# EAGLE design SaintCon2017Badge (EAGLE 7.5.0)
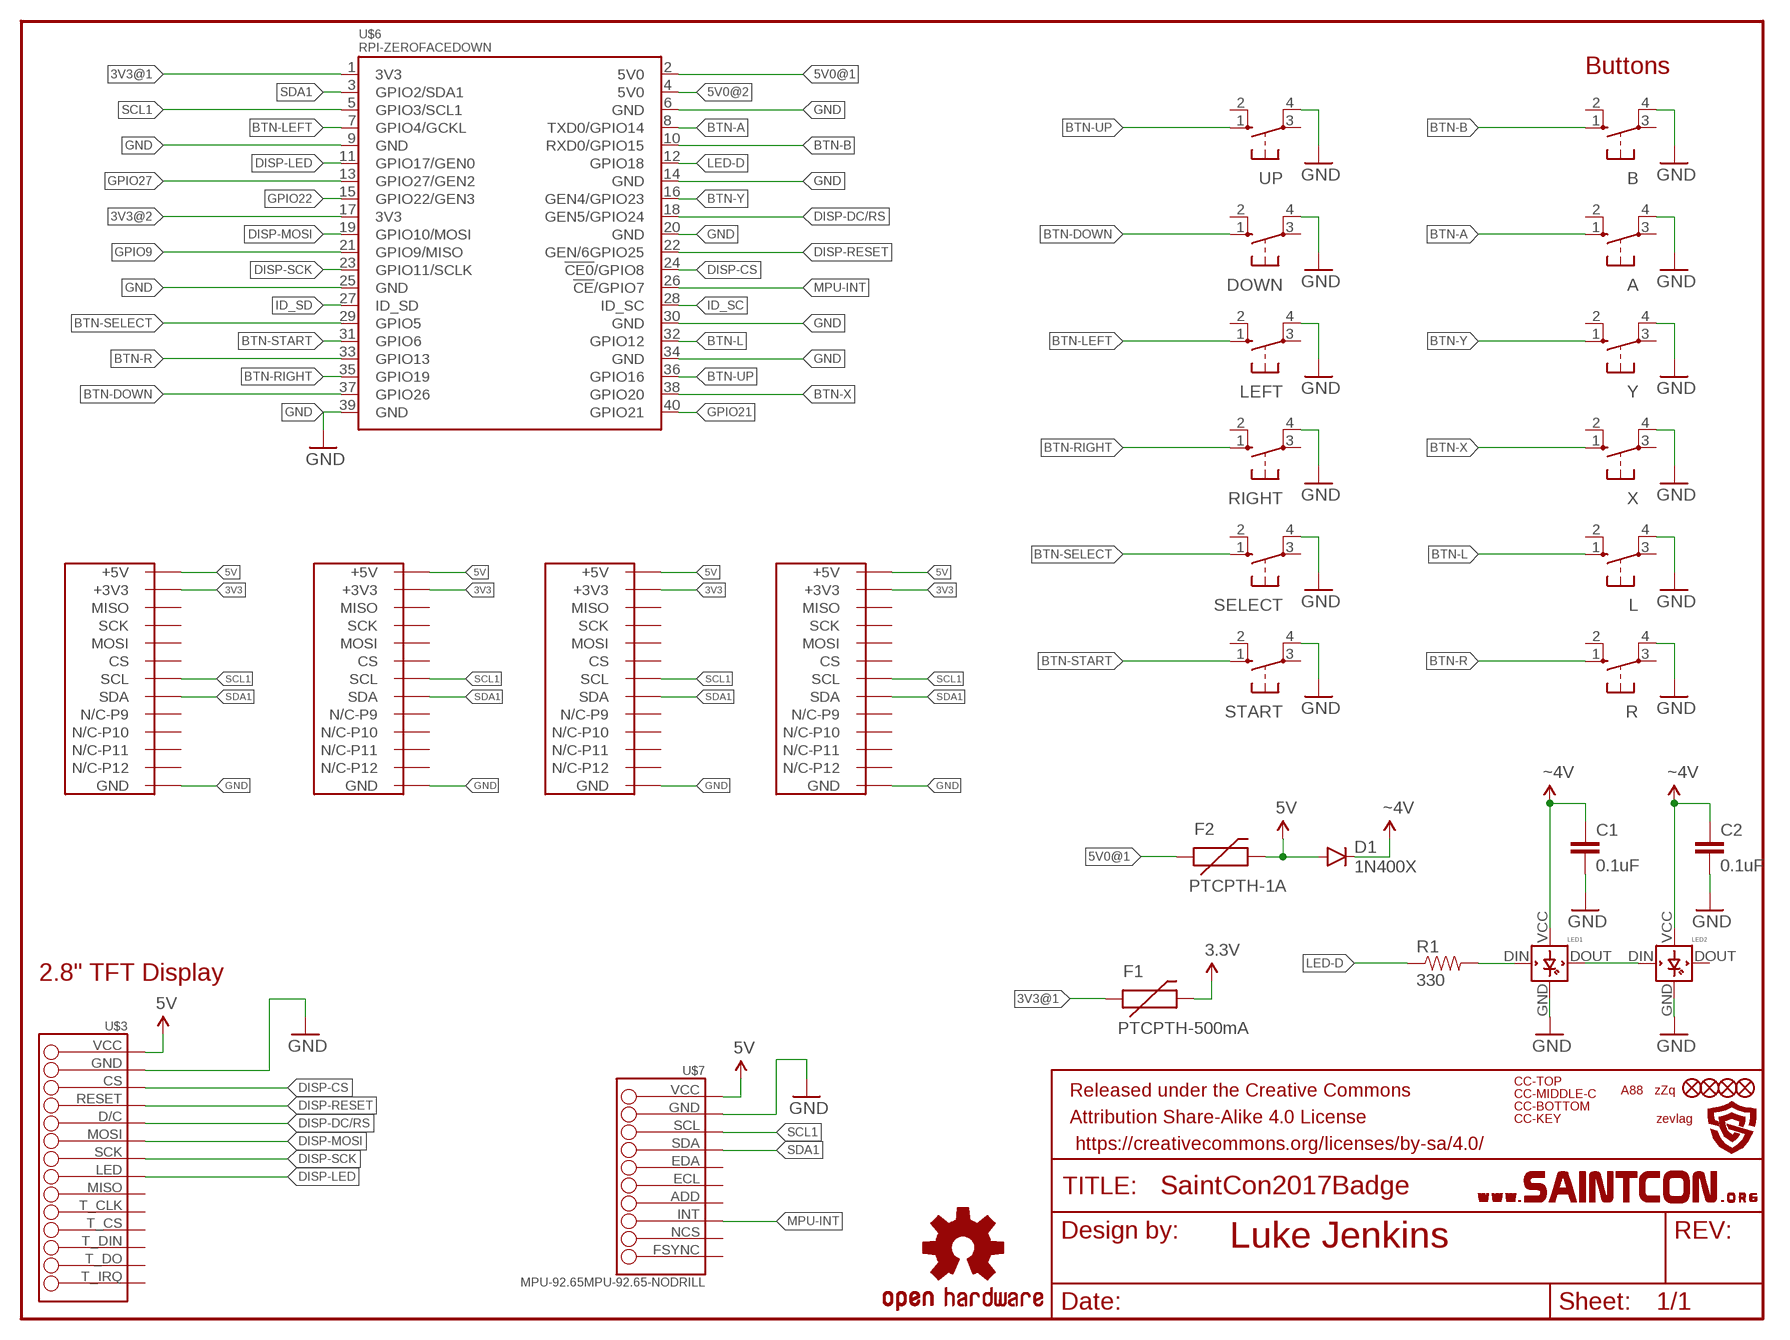
[diagram p0: schematic, sheet 1]

## Parts
A  10-XX  [B3F-10XX]
B  10-XX  [B3F-10XX]
C1  0.1uF  CAPPTH2  [CAP-PTH-SMALL2]
C2  0.1uF  CAPPTH2  [CAP-PTH-SMALL2]
D1  1N400X  DIODEPTH  [DIODE-1N4001]
DOWN  10-XX  [B3F-10XX]
F1  PTCPTH-500mA  PTCPTH  [PTC]
F2  PTCPTH-1A  PTCPTH  [PTC]
FID1  FIDUCIAL1X2  [FIDUCIAL-1X2]
FID2  FIDUCIAL1X2  [FIDUCIAL-1X2]
FID3  FIDUCIAL1X2  [FIDUCIAL-1X2]
FID4  FIDUCIAL1X2  [FIDUCIAL-1X2]
FRAME3  FRAME-LETTERNO_PACKAGE  [DUMMY]
L  10-XX  [B3F-10XX]
LED1  WS2812WS2812-F8-FLIPPED-POWER  [WS2812-F8-FLIPPED-POWER]
LED2  WS2812WS2812-F8-FLIPPED-POWER  [WS2812-F8-FLIPPED-POWER]
LEFT  10-XX  [B3F-10XX]
LOGO1  OSHW-LOGOS-COPPER  [OSHW-LOGO-S_COPPER]
LOGO2  OSHW-LOGOS  [OSHW-LOGO-S]
R  10-XX  [B3F-10XX]
R1  330  RESISTORPTH-1/4W  [AXIAL-0.4]
RIGHT  10-XX  [B3F-10XX]
SELECT  10-XX  [B3F-10XX]
START  10-XX  [B3F-10XX]
U$1  AZZQ  [AZZQ]
U$2  A88  [A88]
U$3  TFT28-14  [TFT28-14]
U$4  SAINTCON-LOGO  [SAINTCON-LOGO]
U$5  SAINTCON-HEADERBLOCKLETTER  [SAINTCON-HEADER-BLOCK-LETTER]
U$6  RPI-ZEROFACEDOWN  [RASP_PI_ZERO_BOARD_FULL]
U$7  MPU-92.65MPU-92.65-NODRILL  [MPU-92.65-NODRILL]
U$8  BADGE64FOOTPRINT-SHINY  [BADGE64-FOOTPRINT-SHINY]
U$9  BADGE64FOOTPRINT-SHINY  [BADGE64-FOOTPRINT-SHINY]
U$10  BADGE64FOOTPRINT-SHINY  [BADGE64-FOOTPRINT-SHINY]
U$11  BADGE64FOOTPRINT-SHINY  [BADGE64-FOOTPRINT-SHINY]
U$12  ZEVLAG2017SOLID-IS-BLACK  [ZEVLAG2017-SOLID-IS-BLACK]
U$13  CC-TOP  [CURIOUSCODES-2017SAINTCON-TOP-LINE]
U$14  CC-MIDDLE-C  [CURIOUSCODES-2017SAINTCON-MIDDLE-C]
U$15  CC-BOTTOM  [CURIOUSCODES-2017SAINTCON-BOTTOM-LINE]
U$16  CC-KEY  [CUROIOUSCODES-KEY-HALF-INCH]
UP  10-XX  [B3F-10XX]
X  10-XX  [B3F-10XX]
Y  10-XX  [B3F-10XX]

## Nets
3V3: F1.P$2 U$8.+3V3-P7(+3V3) U$8.+3V3-P15(+3V3) U$9.+3V3-P7(+3V3) U$9.+3V3-P15(+3V3) U$10.+3V3-P7(+3V3) U$10.+3V3-P15(+3V3) U$11.+3V3-P7(+3V3) U$11.+3V3-P15(+3V3) ; supply symbol labelled 3.3V
3V3@1: F1.P$1 U$6.1(3V3)
3V3@2: U$6.17(3V3)
5V: D1.A F2.P$2 U$3.VCC U$7.VCC U$8.+5V U$9.+5V U$10.+5V U$11.+5V
5V0@1: F2.P$1 U$6.2(5V0)
5V0@2: U$6.4(5V0)
BTN-A: A.1(S) U$6.8(TXD0/GPIO14)
BTN-B: B.1(S) U$6.10(RXD0/GPIO15)
BTN-DOWN: DOWN.1(S) U$6.37(GPIO26)
BTN-L: L.1(S) U$6.32(GPIO12)
BTN-LEFT: LEFT.1(S) U$6.7(GPIO4/GCKL)
BTN-R: R.1(S) U$6.33(GPIO13)
BTN-RIGHT: RIGHT.1(S) U$6.35(GPIO19)
BTN-SELECT: SELECT.1(S) U$6.29(GPIO5)
BTN-START: START.1(S) U$6.31(GPIO6)
BTN-UP: U$6.36(GPIO16) UP.1(S)
BTN-X: U$6.38(GPIO20) X.1(S)
BTN-Y: U$6.16(GEN4/GPIO23) Y.1(S)
DISP-CS: U$3.CS U$6.24(!CE0!/GPIO8)
DISP-DC/RS: U$3.D/C U$6.18(GEN5/GPIO24)
DISP-LED: U$3.LED U$6.11(GPIO17/GEN0)
DISP-MOSI: U$3.MOSI U$6.19(GPIO10/MOSI)
DISP-RESET: U$3.RESET U$6.22(GEN/6GPIO25)
DISP-SCK: U$3.SCK U$6.23(GPIO11/SCLK)
GND: A.4(P1) B.4(P1) C1.2 C2.2 DOWN.4(P1) L.4(P1) LED1.GND LED2.GND LEFT.4(P1) R.4(P1) RIGHT.4(P1) SELECT.4(P1) START.4(P1) U$3.GND U$6.6(GND) U$6.9(GND) U$6.14(GND) U$6.20(GND) U$6.25(GND) U$6.30(GND) U$6.34(GND) U$6.39(GND) U$7.GND U$8.GND-P2(GND) U$8.GND-P8(GND) U$8.GND-P16(GND) U$9.GND-P2(GND) U$9.GND-P8(GND) U$9.GND-P16(GND) U$10.GND-P2(GND) U$10.GND-P8(GND) U$10.GND-P16(GND) U$11.GND-P2(GND) U$11.GND-P8(GND) U$11.GND-P16(GND) UP.4(P1) X.4(P1) Y.4(P1)
GPIO9: U$6.21(GPIO9/MISO)
GPIO21: U$6.40(GPIO21)
GPIO22: U$6.15(GPIO22/GEN3)
GPIO27: U$6.13(GPIO27/GEN2)
ID_SC: U$6.28(ID_SC)
ID_SD: U$6.27(ID_SD)
LED1-LED2: LED1.DOUT LED2.DIN
LED-D: R1.P$1 U$6.12(GPIO18)
MPU-INT: U$6.26(!CE!/GPIO7) U$7.INT
R1-LED1: LED1.DIN R1.P$2
SCL1: U$6.5(GPIO3/SCL1) U$7.SCL U$8.SCL U$9.SCL U$10.SCL U$11.SCL
SDA1: U$6.3(GPIO2/SDA1) U$7.SDA U$8.SDA U$9.SDA U$10.SDA U$11.SDA
VDD: C1.1 C2.1 D1.C LED1.VCC(VDD) LED2.VCC(VDD) ; supply symbol labelled ~4V
Unconnected: A.2(S1) A.3(P) B.2(S1) B.3(P) DOWN.2(S1) DOWN.3(P) L.2(S1) L.3(P) LED2.DOUT LEFT.2(S1) LEFT.3(P) R.2(S1) R.3(P) RIGHT.2(S1) RIGHT.3(P) SELECT.2(S1) SELECT.3(P) START.2(S1) START.3(P) U$3.MISO U$3.T_CLK U$3.T_CS U$3.T_DIN U$3.T_DO U$3.T_IRQ U$7.ADD U$7.ECL U$7.EDA U$7.FSYNC U$7.NCS U$8.CS U$8.MISO U$8.MOSI U$8.NC-P9(N/C-P9) U$8.NC-P10(N/C-P10) U$8.NC-P11(N/C-P11) U$8.NC-P12(N/C-P12) U$8.SCK U$9.CS U$9.MISO U$9.MOSI U$9.NC-P9(N/C-P9) U$9.NC-P10(N/C-P10) U$9.NC-P11(N/C-P11) U$9.NC-P12(N/C-P12) U$9.SCK U$10.CS U$10.MISO U$10.MOSI U$10.NC-P9(N/C-P9) U$10.NC-P10(N/C-P10) U$10.NC-P11(N/C-P11) U$10.NC-P12(N/C-P12) U$10.SCK U$11.CS U$11.MISO U$11.MOSI U$11.NC-P9(N/C-P9) U$11.NC-P10(N/C-P10) U$11.NC-P11(N/C-P11) U$11.NC-P12(N/C-P12) U$11.SCK UP.2(S1) UP.3(P) X.2(S1) X.3(P) Y.2(S1) Y.3(P)

## Notes on the sheet
- Buttons
- 2.8" TFT Display
- Luke Jenkins

## Library data of the parts
A B DOWN L LEFT R RIGHT SELECT START UP X Y = switch-omron:10-XX: OMRON SWITCH; MPN: B3F-1000; OC_FARNELL: 176432; OC_NEWARK: 36M3542
C1 C2 = SparkFun-Capacitors:CAP: Capacitor Standard 0603 ceramic capacitor, and 0.1" leaded capacitor.
D1 = SparkFun-DiscreteSemi:DIODE: Diode These are standard reverse protection diodes and small signal diodes. SMA package can handle up to about 1A. SOD-323 can handle about 200mA. What the SOD-323 package when ordering, there are some mfgs out there that are 5-pin packages.
F1 F2 = SparkFun-PowerIC:PTC: Resettable Fuse PTC Resettable Fuse. Spark Fun Electronics SKU : COM-08357
FID1-FID4 = SparkFun-Aesthetics:FIDUCIAL: Fiducial Alignment Points Various fiducial points for machine vision alignment.
FRAME3 = SparkFun-Aesthetics:FRAME-LETTER: Schematic Frame Standard 8.5x11 US Letter frame; DESIGNER: Nobody; VERSION: v01
LED1 LED2 = zZq:WS2812
LOGO1 LOGO2 = SparkFun-Aesthetics:OSHW-LOGO: Open Source Hardware Logo This logo indicates the piece of hardware it is found on incorporates a OSHW license and/or adheres to the definition of open source hardware found here: http://freedomdefined.org/OSHW
R1 = SparkFun-Passives:RESISTOR: Resistor Basic schematic elements and footprints for 0603, 1206, and PTH resistors.
U$1 = zZq:AZZQ
U$2 = a88:A88
U$3 = zZq:TFT28-14
U$4 = SAINTCON:SAINTCON-LOGO
U$5 = SAINTCON:SAINTCON-HEADER
U$6 = rpi-zero:RPI-ZERO
U$7 = zZq:MPU-92.65
U$8-U$11 = MiniBadge:BADGE64
U$12 = zevlag:ZEVLAG2017
U$13 = curiouscodes:CC-TOP
U$14 = curiouscodes:CC-MIDDLE-C
U$15 = curiouscodes:CC-BOTTOM
U$16 = curiouscodes:CC-KEY

## Board
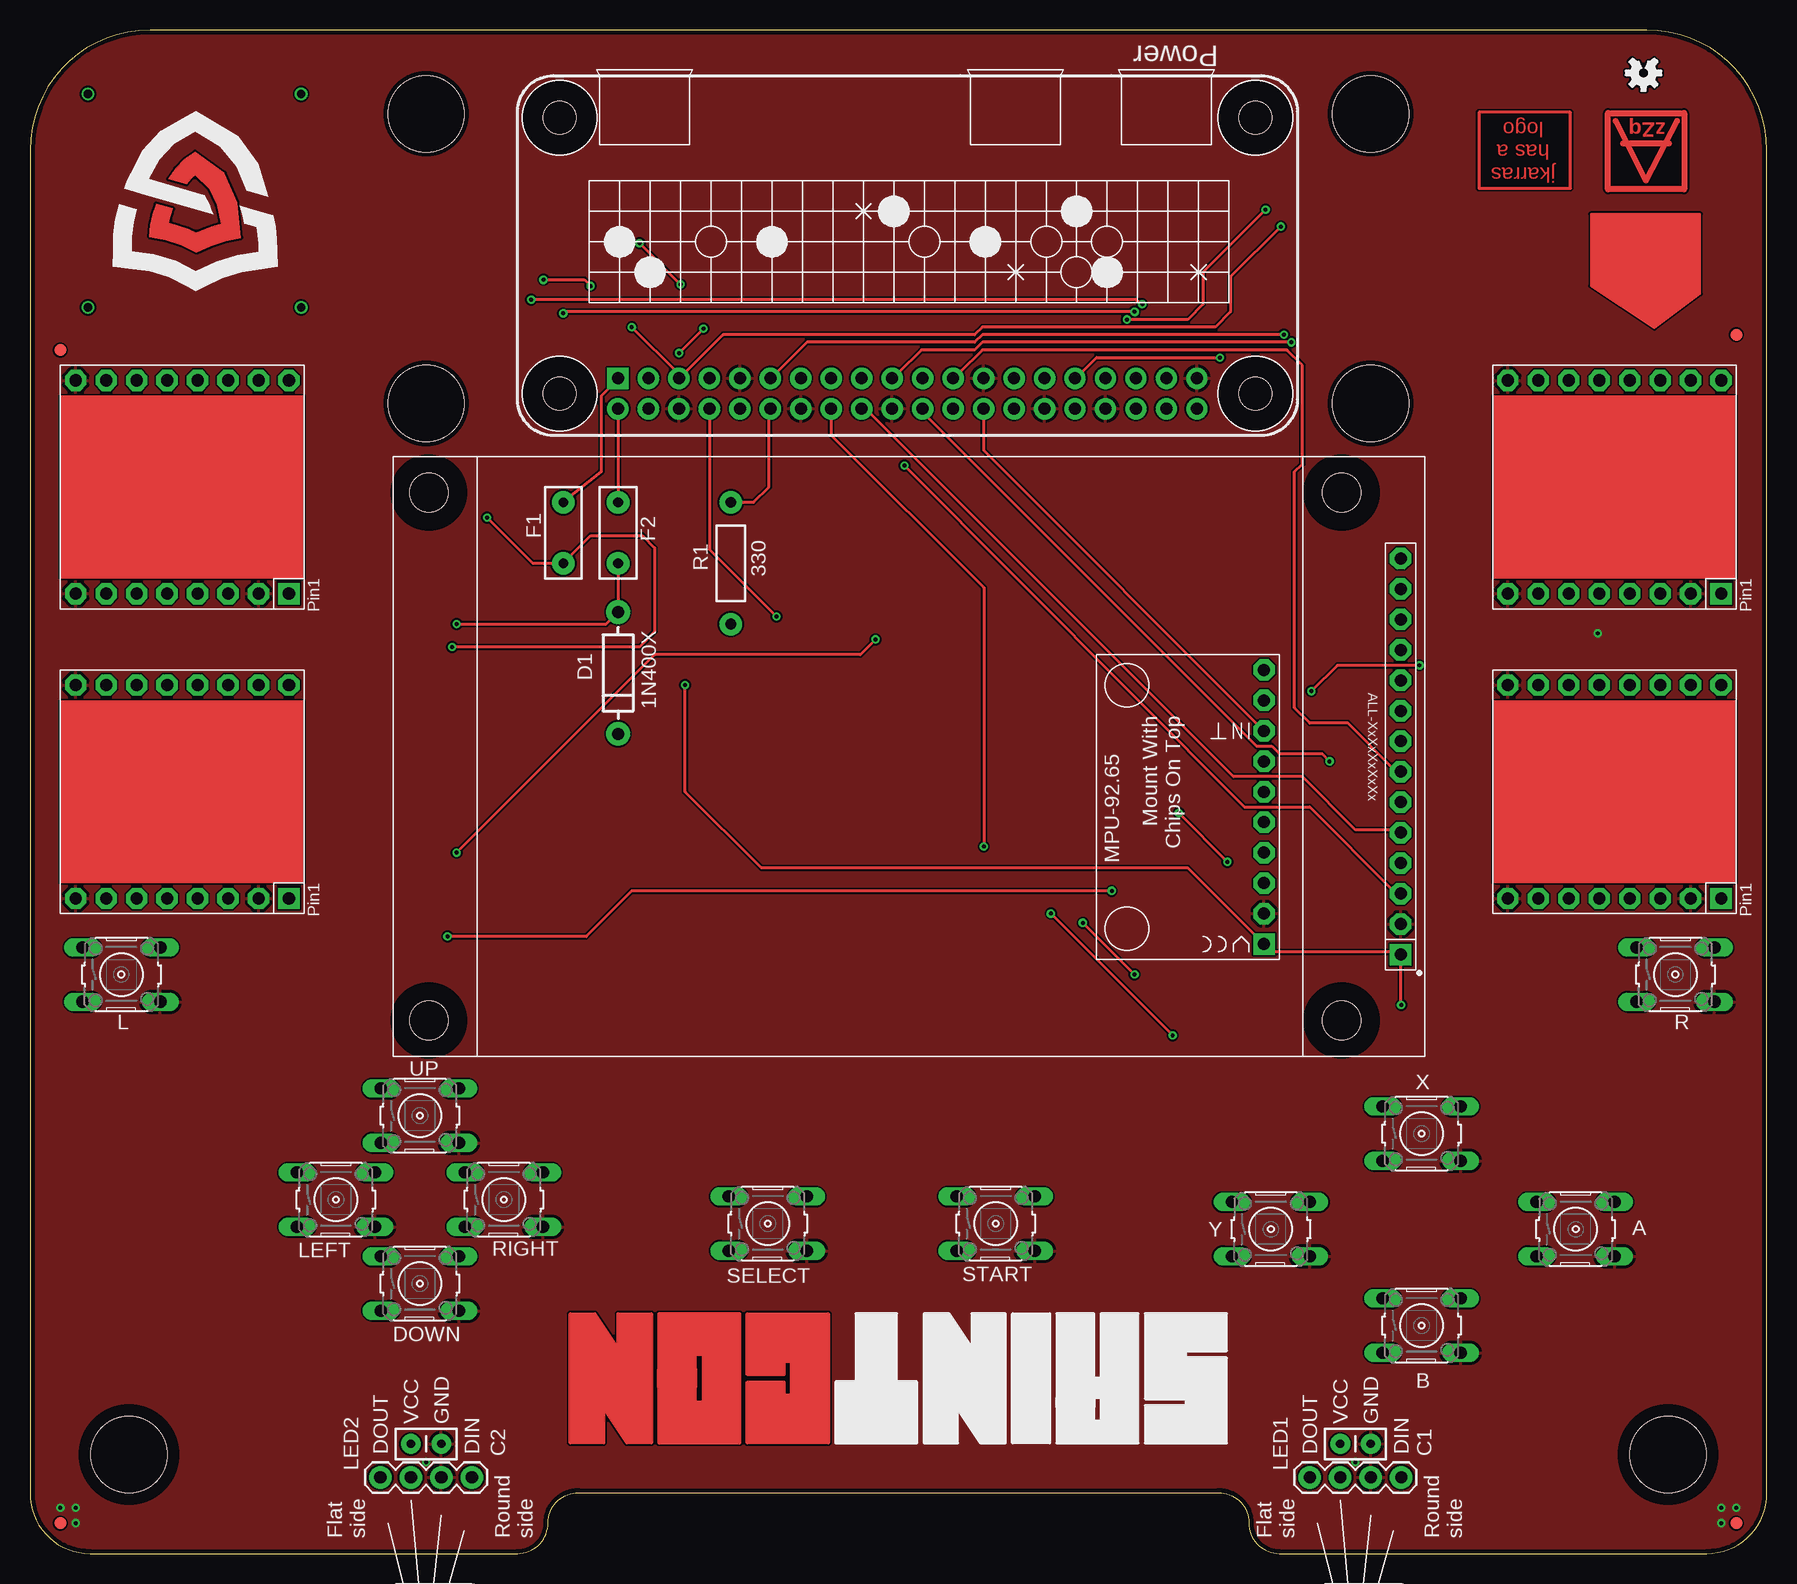
[diagram p1: board, top side]
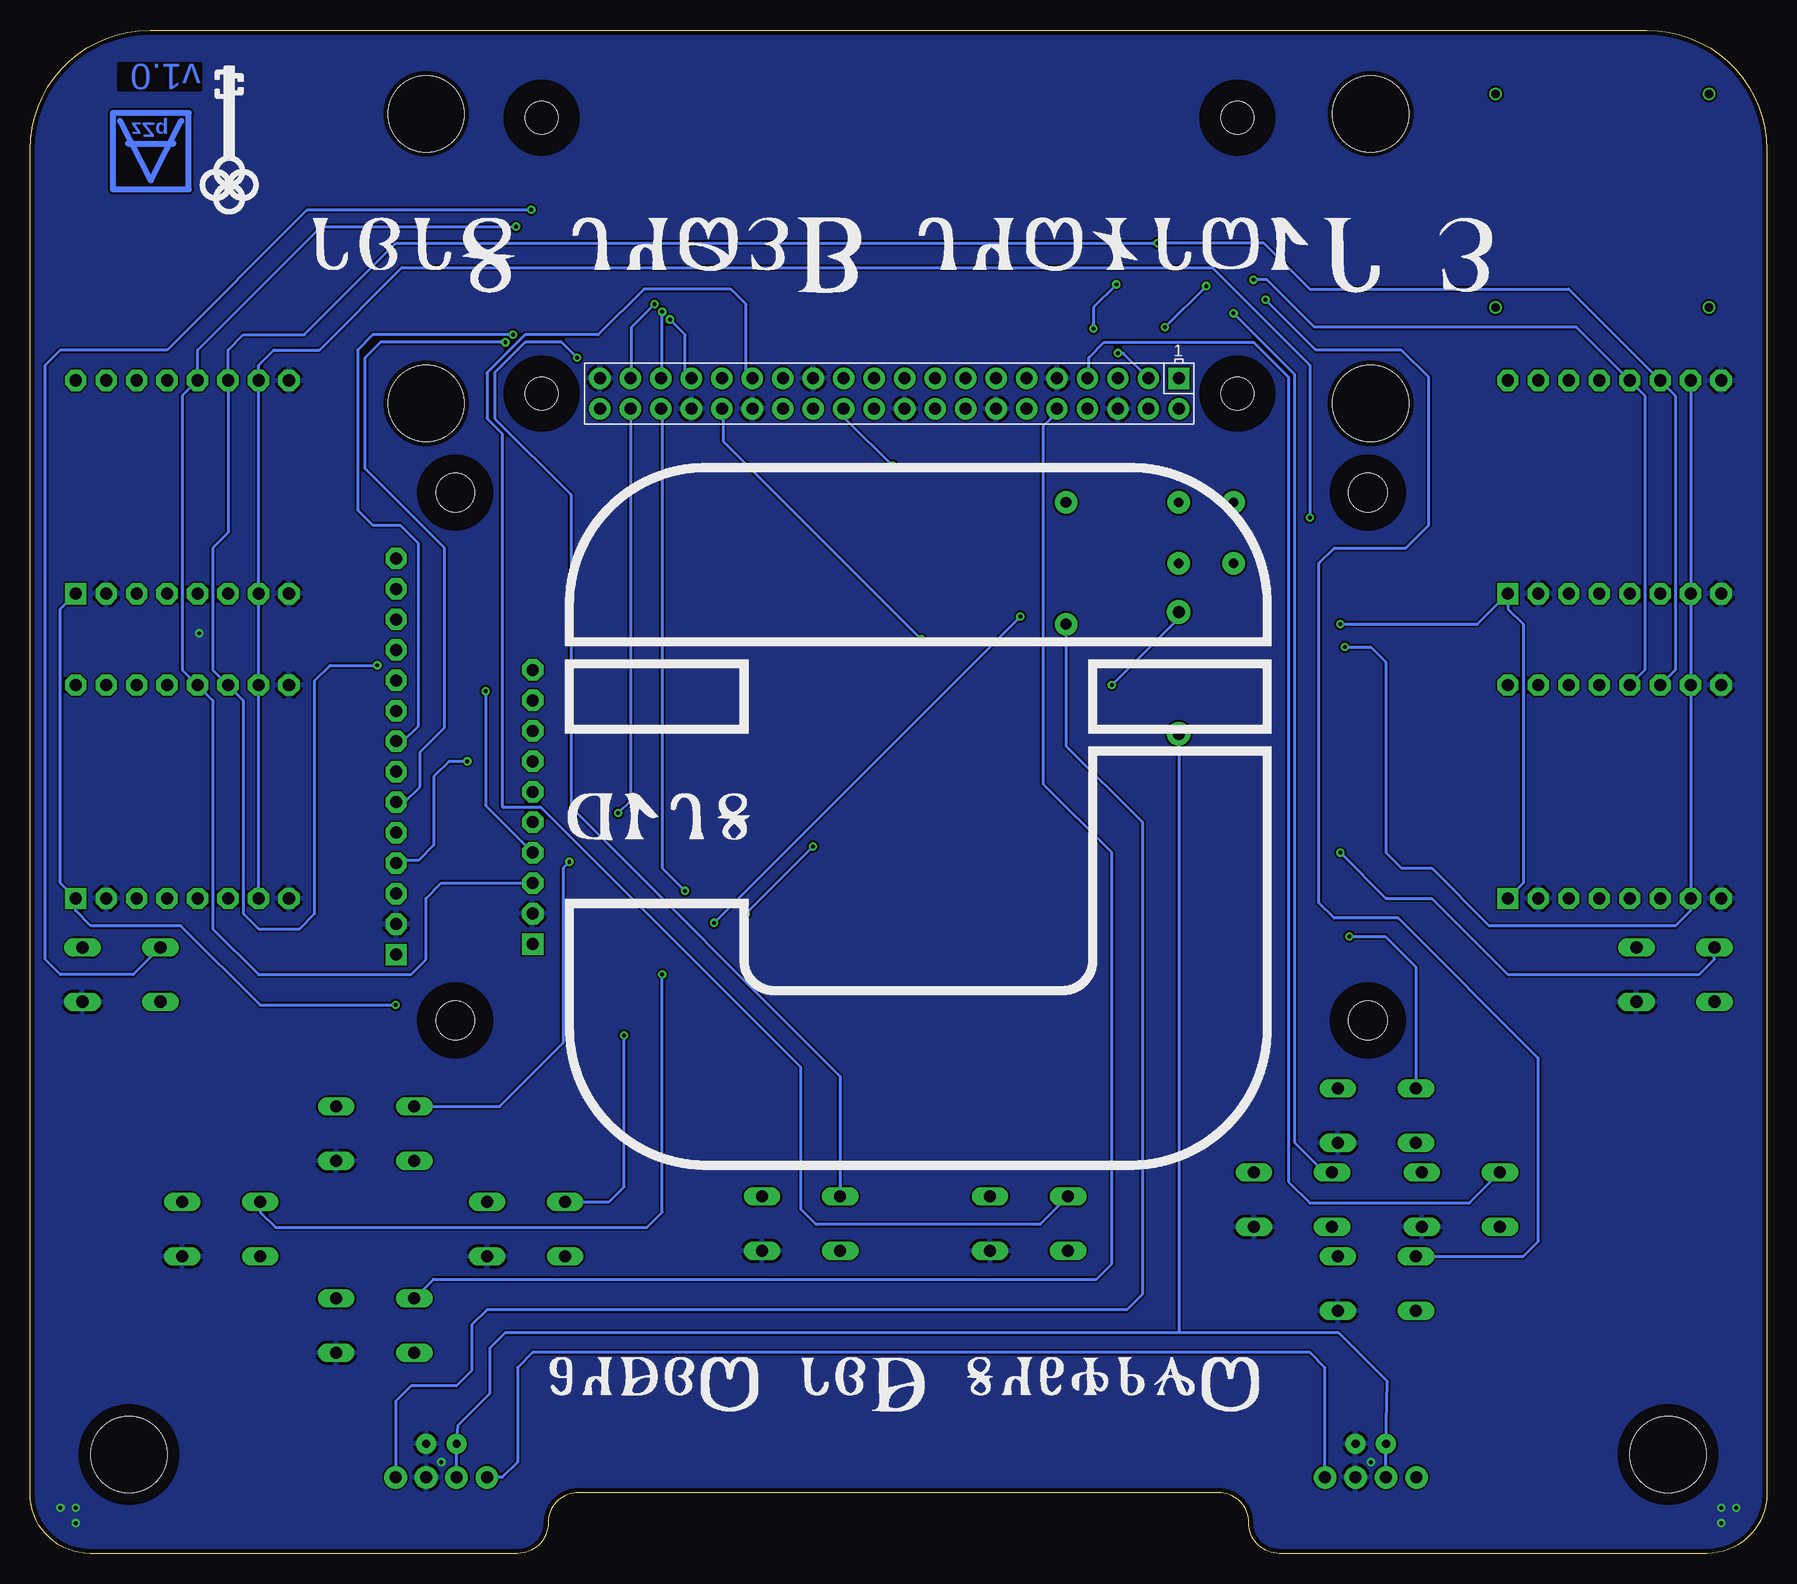
[diagram p2: board, bottom side, seen from below]

Size 144.78 x 127 mm. Coordinates in mm from the lower left corner, seen from the top.
Outline: 104.14,0 139.78,0 arc90 144.78,5 144.78,117 arc90 134.78,127 10,127 arc90 0,117 0,5 arc90 5,0 40.64,0 arc90 43.18,2.54 arc-90 45.72,5.08 99.06,5.08 arc-90 101.6,2.54 arc90 104.14,0
Copper layers (1*16): Top 0.0356mm / dielectric 1.5011mm / Bottom 0.0356mm
Design rules "LaenPCBOrder *": minimum track width 10mil, minimum drill 13mil, track to track 6mil, track to pad 6mil, pad to pad 6mil, via to via 6mil, smd to smd 6mil, copper to edge 15mil, drill to drill 6mil, minimum pad ring 7mil, minimum via ring 7mil, stop-mask expansion 3mil, vias tented up to drill 14mil, thermal gap 10mil
Holes 6.35 mm at 8.26,8.26 136.53,8.26 33.02,120.02 33.02,95.89 111.76,95.89 111.76,120.02
tRestrict: area 4.2,4.2 to 12.3,12.3; area 132.5,4.2 to 140.6,12.3
bRestrict: area 4.2,4.2 to 12.3,12.3; area 132.5,4.2 to 140.6,12.3

### Footprints (pad centres in the part's own frame; a part is rotated, then mirrored left to right if it is on the bottom)
B3F-10XX = drill 1.016 long: 1 -3.251,2.261; 2 3.251,2.261; 3 -3.251,-2.261; 4 3.251,-2.261
CAP-PTH-SMALL2 = drill 0.7 pad 1.651: 1 0,0; 2 2.54,0
DIODE-1N4001 = drill 1 pad 1.981: A -5.08,0; C 5.08,0
PTC = drill 0.8 pad 1.88: P$1 -2.54,0; P$2 2.54,0
FIDUCIAL-1X2 = smd 1 x 1: 1 0,0
WS2812-F8-FLIPPED-POWER = drill 1.016 pad 1.88: DIN 7.62,0; DOUT 0,0; GND 5.08,0; VCC 2.54,0
AXIAL-0.4 = drill 0.9 pad 1.88: P$1 -5.08,0; P$2 5.08,0
TFT28-14 = drill 1 pad 1.778 octagon: CS 2,36.43; D/C 2,31.35; GND 2,38.97; LED 2,23.73; MISO 2,21.19; MOSI 2,28.81; RESET 2,33.89; SCK 2,26.27; T_CLK 2,18.65; T_CS 2,16.11; T_DIN 2,13.57; T_DO 2,11.03; T_IRQ 2,8.49 | drill 1 pad 1.778 square: VCC 2,41.51 | hole 3.2: 6.92,3; 6.92,47; 83,47; 83,3
RASP_PI_ZERO_BOARD_FULL = drill 1 pad 1.778 square: 1 8.37,5.25 | drill 1 pad 1.778: 2 8.37,2.71; 3 10.91,5.25; 4 10.91,2.71; 5 13.45,5.25; 6 13.45,2.71; 7 15.99,5.25; 8 15.99,2.71; 9 18.53,5.25; 10 18.53,2.71; 11 21.07,5.25; 12 21.07,2.71; 13 23.61,5.25; 14 23.61,2.71; 15 26.15,5.25; 16 26.15,2.71; 17 28.69,5.25; 18 28.69,2.71; 19 31.23,5.25; 20 31.23,2.71; 21 33.77,5.25; 22 33.77,2.71; 23 36.31,5.25; 24 36.31,2.71; 25 38.85,5.25; 26 38.85,2.71; 27 41.39,5.25; 28 41.39,2.71; 29 43.93,5.25; 30 43.93,2.71; 31 46.47,5.25; 32 46.47,2.71; 33 49.01,5.25; 34 49.01,2.71; 35 51.55,5.25; 36 51.55,2.71; 37 54.09,5.25; 38 54.09,2.71; 39 56.63,5.25; 40 56.63,2.71 | hole 2.75: 3.5,26.98; 3.5,3.98; 61.5,26.98; 61.5,3.98
MPU-92.65-NODRILL = drill 1 pad 1.778 octagon: ADD 1.27,8.89; ECL 1.27,11.43; EDA 1.27,13.97; FSYNC 1.27,1.27; GND 1.27,21.59; INT 1.27,6.35; NCS 1.27,3.81; SCL 1.27,19.05; SDA 1.27,16.51 | drill 1 pad 1.778 square: VCC 1.27,24.13
BADGE64-FOOTPRINT-SHINY = drill 1.016 pad 1.778 octagon: +3V3-P7 15.24,0; +3V3-P15 15.24,-17.78; CS 12.7,0; GND-P2 2.54,0; GND-P8 17.78,0; GND-P16 17.78,-17.78; MISO 5.08,0; MOSI 10.16,0; NC-P9 0,-17.78; NC-P10 2.54,-17.78; NC-P11 5.08,-17.78; NC-P12 7.62,-17.78; SCK 7.62,0; SCL 10.16,-17.78; SDA 12.7,-17.78 | drill 1.016 pad 1.778 square: +5V 0,0

### Placement (x,y rotation side)
A  128.84,27.04 0 top
B  116,19 0 top
C1  109.22,9.14 0 top
C2  31.75,9.14 0 top
D1  49.02,73.41 270 top
DOWN  32.5,22.5 0 top
F1  44.45,85.09 270 top
F2  49.02,85.09 270 top
FID1  2.54,2.54 0 top
FID2  142.24,2.54 0 top
FID3  2.54,100.33 0 top
FID4  142.24,101.6 0 top
FRAME3  0,0 0 top
L  7.62,48.26 0 top
LED1  106.68,6.35 0 top
LED2  29.21,6.35 0 top
LEFT  25.5,29.5 0 top
LOGO1  134.49,123.42 180 top
LOGO2  134.49,123.42 180 top
R  137.16,48.26 0 top
R1  58.42,82.55 270 top
RIGHT  39.5,29.5 0 top
SELECT  61.5,27.5 0 top
START  80.5,27.5 0 top
U$1  134.62,116.84 180 top
U$2  140.97,111.76 180 top
U$3  116.26,91.44 180 top
U$4  13.72,112.78 180 top
U$5  72.39,14.61 180 top
U$6  40.64,92.71 0 top
U$7  104.14,74.93 180 top
U$8  21.59,80.01 180 top
U$9  21.59,54.61 180 top
U$10  140.97,80.01 180 top
U$11  140.97,54.61 180 top
U$12  73.28,109.35 180 top
U$13  42.29,16.51 180 bottom
U$14  40.64,91.44 180 bottom
U$15  22.86,111.76 180 bottom
U$16  128.14,114.05 180 bottom
UP  32.5,36.5 0 top
X  116,35 0 top
Y  103.43,27.04 0 top

### Tracks (layer width: path | path; a pad name or v marks a point on that pad's centre or on a via)
3V3  (via drill 0.33)
  Top 0.254: v35.18,75.56 50.8,75.56 52.07,76.83 52.07,83.82 51.05,84.84 46.74,84.84 F1.P$2 41.91,82.55 v38.1,86.36
  Bottom 0.254: U$11.+3V3-P7 U$11.+3V3-P15 U$10.+3V3-P7 U$10.+3V3-P15 125.73,99.06 124.46,100.33 120.65,100.33 113.79,107.19 46.23,107.19 38.1,99.06 v38.1,86.36 | U$8.+3V3-P15 U$8.+3V3-P7 U$9.+3V3-P15 U$9.+3V3-P7 6.35,53.59 7.62,52.32 23.11,52.32 27.94,57.15 30.48,57.15 31.75,58.42 31.75,74.3 33.02,75.56 v35.18,75.56
3V3@1
  Top 0.254: U$6.1 48.9,97.79 47.62,96.52 47.62,90.17 F1.P$1
5V  (via drill 0.33)
  Top 0.254: v54.61,72.39 54.61,63.5 60.96,57.15 96.52,57.15 U$7.VCC 103.5,50.16 113.67,50.16 U$3.VCC 114.26,45.76 v114.3,45.72 | v35.56,77.47 48.01,77.47 D1.A F2.P$2
  Bottom 0.254: v54.61,72.39 49.02,77.98 D1.A | U$9.+5V 20.32,55.88 20.32,77.47 21.59,78.74 U$8.+5V 24.13,77.47 v35.56,77.47 | U$10.+5V 142.24,78.74 142.24,55.88 U$11.+5V 140.97,53.59 139.7,52.32 132.21,52.32 125.6,45.72 v114.3,45.72
5V0@1
  Top 0.254: U$6.2 arc-90 49.02,95.41 F2.P$1
BTN-A  (via drill 0.33)
  Top 0.254: v87.76,52.58 v92.08,48.26 | U$6.8 56.63,83.7 v62.23,78.11
  Bottom 0.254: v87.76,52.58 v62.23,78.11 | A.1 125.59,28.45 124.32,27.18 93.34,27.18 92.08,28.45 v92.08,48.26
BTN-B
  Bottom 0.254: U$6.10 59.69,95.25 59.69,94.61 60.33,93.98 60.33,64.14 54.61,58.42 54.61,24.13 55.88,22.86 111.15,22.86 B.1
BTN-DOWN  (via drill 0.33)
  Top 0.254: v92.71,104.14 92.2,104.52 v41.78,104.52
  Bottom 0.254: v92.71,104.14 94.61,102.23 94.61,98.42 U$6.37 | DOWN.1 20.32,24.76 19.05,26.03 19.05,41.27 30.73,52.96 36.07,52.96 37.34,54.23 37.34,82.55 36.07,83.82 30.1,83.82 28.19,85.72 28.19,98.04 30.48,100.33 37.59,100.33 v41.78,104.52
BTN-L  (via drill 0.33)
  Top 0.254: v35.56,58.42 52.07,74.93 69.22,74.93 v70.48,76.2
  Bottom 0.254: v35.56,58.42 31.75,54.61 27.94,54.61 21.59,48.26 5.64,48.26 4.37,49.53 L.1 | v70.48,76.2 87,92.71 87,95.25 U$6.32
BTN-LEFT
  Bottom 0.254: U$6.7 56.52,98.42 56.52,99.69 55.24,100.97 42.8,100.97 39.88,98.04 39.88,30.99 38.1,29.21 24.8,29.21 LEFT.1
BTN-R  (via drill 0.33)
  Top 0.254: v91.44,102.87 96.52,102.87 97.79,104.14 97.79,106.81 v103,112.01
  Bottom 0.254: v91.44,102.87 90.17,101.6 90.17,98.42 U$6.33 | R.1 136.17,48.26 142.24,48.26 143.51,49.53 143.51,99.06 142.24,100.33 133.35,100.33 121.67,112.01 v103,112.01
BTN-RIGHT  (via drill 0.33)
  Top 0.254: v44.45,103.38 44.58,103.5 v92.08,103.5
  Bottom 0.254: v44.45,103.38 39.37,98.3 39.37,34.29 36.83,31.75 RIGHT.1 | v92.08,103.5 92.08,98.42 U$6.35
BTN-SELECT
  Bottom 0.254: U$6.29 85.09,98.42 85.09,104.14 86.36,105.41 93.6,105.41 97.41,101.6 103.5,101.6 106.68,98.42 106.68,94.61 105.41,93.34 105.41,62.23 102.23,62.23 80.52,40.51 80.52,28.7 79.25,27.43 60.58,27.43 SELECT.1
BTN-START  (via drill 0.33)
  Top 0.254: v99.19,99.69 88.9,99.69 87.63,98.42 U$6.31
  Bottom 0.254: v99.19,99.69 100.46,100.97 103.5,100.97 106.05,98.42 106.05,94.61 99.69,88.27 99.69,62.23 77.25,39.78 START.1
BTN-UP  (via drill 0.33)
  Top 0.254: v90.17,55.24 50.16,55.24 46.35,51.44 v34.8,51.44
  Bottom 0.254: v90.17,55.24 92.08,57.15 92.08,95.25 U$6.36 | v34.8,51.44 31.79,51.44 29.25,48.9 UP.1
BTN-X  (via drill 0.33)
  Top 0.254: v95.76,61.72 v99.82,57.66
  Bottom 0.254: U$6.38 94.73,62.75 v95.76,61.72 | v99.82,57.66 100.33,57.15 100.33,42.55 105.61,37.26 X.1
BTN-Y  (via drill 0.33)
  Top 0.254: v85.09,53.34 v95.25,43.18 | U$6.16 66.79,93.23 79.5,80.52 v79.5,58.93
  Bottom 0.254: v79.5,58.93 v85.09,53.34 | Y.1 96.52,29.3 95.25,30.57 v95.25,43.18
DISP-CS  (via drill 0.33)
  Top 0.254: v72.9,90.68 101.22,62.23 106.68,62.23 113.67,55.24 U$3.CS
  Bottom 0.254: v72.9,90.68 76.83,94.61 76.83,95.25 U$6.24
DISP-DC/RS
  Top 0.254: U$6.18 69.85,95.25 100.33,64.77 106.05,64.77 110.49,60.33 113.67,60.33 U$3.D/C
DISP-LED  (via drill 0.33)
  Top 0.254: v104.52,101.6 79.38,101.6 78.74,100.97 64.77,100.97 62.23,98.42 U$6.11
  Bottom 0.254: v104.52,101.6 116.2,101.6 117.47,100.33 117.47,87 116.2,85.72 113.92,85.72 112.39,84.2 112.39,68.98 113.67,67.71 U$3.LED
DISP-MOSI  (via drill 0.33)
  Top 0.254: v105.16,100.97 79.38,100.97 78.74,100.33 74.3,100.33 72.39,98.42 U$6.19
  Bottom 0.254: v105.16,100.97 115.57,100.97 116.84,99.69 116.84,90.42 110.24,83.82 110.24,68.83 112.27,66.8 112.27,63.9 113.54,62.63 U$3.MOSI
DISP-RESET  (via drill 0.33)
  Top 0.254: v108.33,66.04 107.7,66.67 104.14,66.67 103.5,67.31 102.23,67.31 74.3,95.25 U$6.22
  Bottom 0.254: v108.33,66.04 109.86,66.04 111.12,64.77 111.12,59.05 112.39,57.78 113.67,57.78 U$3.RESET
DISP-SCK
  Top 0.254: U$6.23 77.47,98.42 79.38,100.33 104.78,100.33 106.05,99.06 106.05,90.81 105.41,90.17 105.41,70.48 106.68,69.22 109.86,69.22 113.67,65.41 U$3.SCK
GND  (via drill 0.33)
  other vias: 140.97,3.81 3.81,3.81 33.02,7.62 110.49,7.62 2.54,3.81 3.81,2.54 142.24,3.81 140.97,2.54 130.68,76.71
  pour Top: 0,127 144.78,127 144.78,0 0,0
  pour Bottom: 0,127 144.78,127 144.78,0 0,0
LED1-LED2
  Bottom 0.254: LED2.DIN 36.83,15.49 38.1,16.76 102.87,16.76 104.14,15.49 104.14,7.62 105.41,6.35 LED1.DOUT
LED-D
  Top 0.254: R1.P$1 60.33,87.63 61.59,88.9 61.59,95.25 U$6.12
MPU-INT
  Top 0.254: U$6.26 79.49,91.96 U$7.INT
N$1
  Top 0.254: 128.4,113.79 128.4,120.14 120.78,120.14 120.78,113.79 128.4,113.79
N$4  (via drill 0.7)
  other vias: 4.83,121.67
N$5  (via drill 0.7)
  other vias: 22.61,121.67
N$6  (via drill 0.7)
  other vias: 4.83,103.89
N$7  (via drill 0.7)
  other vias: 22.61,103.89
R1-LED1
  Bottom 0.254: R1.P$2 58.42,67.31 52.07,60.96 52.07,21.59 53.34,20.32 106.68,20.32 107.95,19.05 107.95,15.24 109.22,13.97 113.03,13.97 114.3,12.7 LED1.DIN
SCL1  (via drill 0.33)
  Top 0.254: v50.16,102.23 53.98,98.42 U$6.5 54.61,98.42 57.78,101.6 78.74,101.6 79.38,102.23 98.81,102.23 100.08,103.5 100.08,106.43 v104.27,110.62 | v42.8,106.17 46.23,106.17 v46.74,105.66
  Bottom 0.254: U$9.SCL 10.16,73.66 10.16,96.52 U$8.SCL 15.88,102.23 37.72,102.23 41.66,106.17 v42.8,106.17 | v46.74,105.66 v50.16,102.23 | v104.27,110.62 120.52,110.62 130.81,100.33 U$10.SCL 132.08,96.52 132.08,73.66 U$11.SCL 129.54,71.12 129.54,52.07 125.73,48.26 113.03,48.26 111.76,49.53 111.76,54.61 110.49,55.88 U$7.SCL
SDA1  (via drill 0.33)
  Top 0.254: v115.82,74.04 108.97,74.04 v106.81,71.88 | v54.1,100.08 v56.13,102.11 | v50.8,109.22 v54.23,105.79
  Bottom 0.254: U$7.SDA 106.81,62.36 v106.81,71.88 | U$9.SDA 7.62,73.66 7.62,96.52 U$8.SDA 16.51,105.41 38.1,105.41 41.91,109.22 v50.8,109.22 114.3,109.22 121.92,101.6 127,101.6 128.27,100.33 U$10.SDA 128.27,85.09 129.54,83.82 129.54,73.66 U$11.SDA 127,71.12 127,53.34 125.73,52.07 122.3,52.07 121.03,53.34 121.03,72.77 119.76,74.04 v115.82,74.04 | U$6.3 53.67,100.08 v54.1,100.08 | 56.13,102.62 v56.13,102.11 56.13,103.89 v54.23,105.79
VDD
  Bottom 0.254: 49.02,18.41 35.69,18.41 31.62,14.35 C2.1 LED2.VCC | 49.02,18.41 105.16,18.41 106.43,17.14 106.43,13.34 109.09,10.67 C1.1 LED1.VCC | D1.C 49.02,18.41

### Text on the board
Top: jkarras / has a / logo
Bottom: v1.0
tPlace: Power | ALL-XxXxXxXxXx